# Altium schematic sheet Connectors.SchDoc: CONNECTORS
size A4; DocumentNumber: 2; SheetNumber: 2; SheetTotal: 18
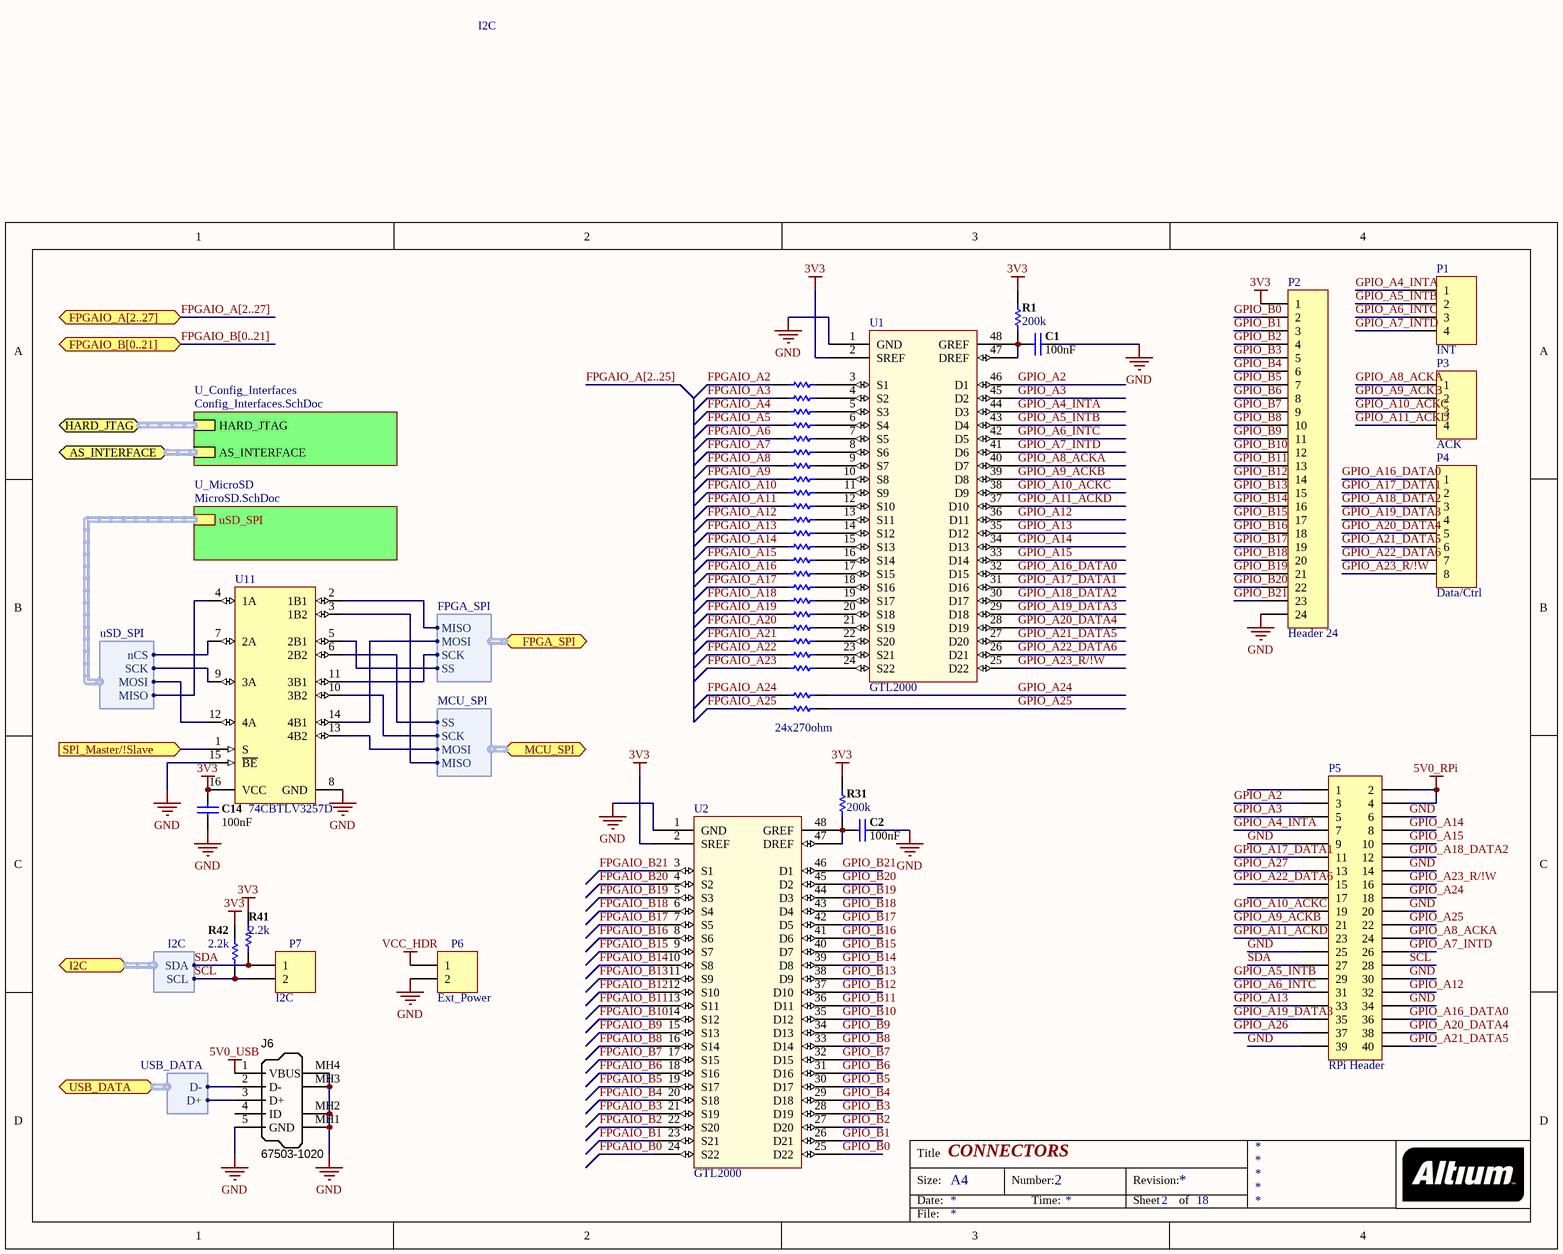
[diagram p0: Connectors.SchDoc]

## Parts
C1  100nF  [0805C-GENERIC]
C2  100nF  [0805C-GENERIC]
C14  100nF  [0805C-GENERIC]
J6  Manufacturer Part Number 1: 67503-1020  [USB_Mini-B_Molex_SMT]  (hidden comment: USB_Mini-B)
P1  Header 4  [HEADER-1X4]  (value not drawn)
P2  Header 24  [HDR1X24]
P3  Header 4  [HEADER-1X4]  (value not drawn)
P4  Header 8  [HEADER-1X8]  (value not drawn)
P5  Header 20X2  (value not drawn)
P6  Header 2  [Connector Molex 2]  (value not drawn)
P7  Header 2  [HEADER-1X2]  (value not drawn)
R1  200k  [0805R-220K]
R2  270  [0805R-270]  (value not drawn)
R5  270  [0805R-270]  (value not drawn)
R14  270  [0805R-270]  (value not drawn)
R15  270  [0805R-270]  (value not drawn)
R16  270  [0805R-270]  (value not drawn)
R17  270  [0805R-270]  (value not drawn)
R18  270  [0805R-270]  (value not drawn)
R19  270  [0805R-270]  (value not drawn)
R20  270  [0805R-270]  (value not drawn)
R21  270  [0805R-270]  (value not drawn)
R22  270  [0805R-270]  (value not drawn)
R23  270  [0805R-270]  (value not drawn)
R24  270  [0805R-270]  (value not drawn)
R25  270  [0805R-270]  (value not drawn)
R26  270  [0805R-270]  (value not drawn)
R27  270  [0805R-270]  (value not drawn)
R28  270  [0805R-270]  (value not drawn)
R29  270  [0805R-270]  (value not drawn)
R30  270  [0805R-270]  (value not drawn)
R31  200k  [0805R-220K]
R35  270  [0805R-270]  (value not drawn)
R36  270  [0805R-270]  (value not drawn)
R37  270  [0805R-270]  (value not drawn)
R38  270  [0805R-270]  (value not drawn)
R39  270  [0805R-270]  (value not drawn)
R41  2.2k  [0805R-0R1]
R42  2.2k  [0805R-0R1]
U1  GTL2000  [TSSOP50P810X120-48N]
U2  GTL2000  [TSSOP50P810X120-48N]
U11  74CBTLV3257D  [SO16]

## Sub-sheets
U_Config_Interfaces = Config_Interfaces.SchDoc: HARD_JTAG (harness HARD_JTAG), AS_INTERFACE (harness AS_INTERFACE)
U_MicroSD = MicroSD.SchDoc: uSD_SPI (harness uSD_SPI)

## Ports
AS_INTERFACE (harness AS_INTERFACE), FPGA_SPI (harness FPGA_SPI), FPGAIO_A[2..27] (bidir), FPGAIO_B[0..21] (bidir, harness TEST_INT), HARD_JTAG (harness HARD_JTAG), I2C (harness I2C), MCU_SPI (harness MCU_SPI), SPI_Master/!Slave (in), USB_DATA (harness USB_DATA)

## Harnesses
USB_DATA: D-, D+
FPGA_SPI: MISO, MOSI, SCK, SS
MCU_SPI: MISO, MOSI, SCK, SS
uSD_SPI: nCS, MOSI, MISO, SCK
I2C: SDA, SCL

## Nets
3V3: C14.1 P2.1 R1.2 R31.2 R41.1 R42.1 U1.2(SREF) U2.2(SREF) U11.16(VCC)
5V0_RPi: P5.2 P5.4
5V0_USB: J6.1(VBUS)
GND: C1.2 C2.2 C14.2 J6.5(GND) J6.MH1(Shell) J6.MH2(Shell) J6.MH3(Shell) J6.MH4(Shell) P2.24 P5.6 P5.9 P5.14 P5.20 P5.25 P5.30 P5.34 P5.39 P6.2 U1.1(GND) U2.1(GND) U11.8(GND) U11.15(~{BE})
VCC_HDR: P6.1
FPGAIO_A2: R2.1
FPGAIO_A3: R5.1
FPGAIO_A4: R37.1
FPGAIO_A5: R38.1
FPGAIO_A6: R39.1
FPGAIO_A7: R14.1
FPGAIO_A8: R15.1
FPGAIO_A9: R16.1
FPGAIO_A10: R17.1
FPGAIO_A11: R18.1
FPGAIO_A12: R19.1
FPGAIO_A13: R20.1
FPGAIO_A14: R21.1
FPGAIO_A15: R22.1
FPGAIO_A16: R23.1
FPGAIO_A17: R24.1
FPGAIO_A18: R25.1
FPGAIO_A19: R26.1
FPGAIO_A20: R27.1
FPGAIO_A21: R28.1
FPGAIO_A22: R29.1
FPGAIO_A23: R30.1
FPGAIO_A24: R35.1
FPGAIO_A25: R36.1
FPGAIO_B0: U2.24(S22)
FPGAIO_B1: U2.23(S21)
FPGAIO_B2: U2.22(S20)
FPGAIO_B3: U2.21(S19)
FPGAIO_B4: U2.20(S18)
FPGAIO_B5: U2.19(S17)
FPGAIO_B6: U2.18(S16)
FPGAIO_B7: U2.17(S15)
FPGAIO_B8: U2.16(S14)
FPGAIO_B9: U2.15(S13)
FPGAIO_B10: U2.14(S12)
FPGAIO_B11: U2.13(S11)
FPGAIO_B12: U2.12(S10)
FPGAIO_B13: U2.11(S9)
FPGAIO_B14: U2.10(S8)
FPGAIO_B15: U2.9(S7)
FPGAIO_B16: U2.8(S6)
FPGAIO_B17: U2.7(S5)
FPGAIO_B18: U2.6(S4)
FPGAIO_B19: U2.5(S3)
FPGAIO_B20: U2.4(S2)
FPGAIO_B21: U2.3(S1)
GPIO_A2: P5.3 U1.46(D1)
GPIO_A3: P5.5 U1.45(D2)
GPIO_A4_INTA: P1.1 P5.7 U1.44(D3)
GPIO_A5_INTB: P1.2 P5.29 U1.43(D4)
GPIO_A6_INTC: P1.3 P5.31 U1.42(D5)
GPIO_A7_INTD: P1.4 P5.26 U1.41(D6)
GPIO_A8_ACKA: P3.1 P5.24 U1.40(D7)
GPIO_A9_ACKB: P3.2 P5.21 U1.39(D8)
GPIO_A10_ACKC: P3.3 P5.19 U1.38(D9)
GPIO_A11_ACKD: P3.4 P5.23 U1.37(D10)
GPIO_A12: P5.32 U1.36(D11)
GPIO_A13: P5.33 U1.35(D12)
GPIO_A14: P5.8 U1.34(D13)
GPIO_A15: P5.10 U1.33(D14)
GPIO_A16_DATA0: P4.1 P5.36 U1.32(D15)
GPIO_A17_DATA1: P4.2 P5.11 U1.31(D16)
GPIO_A18_DATA2: P4.3 P5.12 U1.30(D17)
GPIO_A19_DATA3: P4.4 P5.35 U1.29(D18)
GPIO_A20_DATA4: P4.5 P5.38 U1.28(D19)
GPIO_A21_DATA5: P4.6 P5.40 U1.27(D20)
GPIO_A22_DATA6: P4.7 P5.15 U1.26(D21)
GPIO_A23_R/!W: P4.8 P5.16 U1.25(D22)
GPIO_A24: P5.18 R35.2
GPIO_A25: P5.22 R36.2
GPIO_A26: P5.37
GPIO_A27: P5.13
GPIO_B0: P2.2 U2.25(D22)
GPIO_B1: P2.3 U2.26(D21)
GPIO_B2: P2.4 U2.27(D20)
GPIO_B3: P2.5 U2.28(D19)
GPIO_B4: P2.6 U2.29(D18)
GPIO_B5: P2.7 U2.30(D17)
GPIO_B6: P2.8 U2.31(D16)
GPIO_B7: P2.9 U2.32(D15)
GPIO_B8: P2.10 U2.33(D14)
GPIO_B9: P2.11 U2.34(D13)
GPIO_B10: P2.12 U2.35(D12)
GPIO_B11: P2.13 U2.36(D11)
GPIO_B12: P2.14 U2.37(D10)
GPIO_B13: P2.15 U2.38(D9)
GPIO_B14: P2.16 U2.39(D8)
GPIO_B15: P2.17 U2.40(D7)
GPIO_B16: P2.18 U2.41(D6)
GPIO_B17: P2.19 U2.42(D5)
GPIO_B18: P2.20 U2.43(D4)
GPIO_B19: P2.21 U2.44(D3)
GPIO_B20: P2.22 U2.45(D2)
GPIO_B21: P2.23 U2.46(D1)
SCL: P5.28 P7.2 R42.2 ; port I2C.SCL
SDA: P5.27 P7.1 R41.2 ; port I2C.SDA
SPI_Master/!Slave: U11.1(S) ; port SPI_Master/!Slave
NetC1_1: C1.1 R1.1 U1.47(DREF) U1.48(GREF)
NetC2_1: C2.1 R31.1 U2.47(DREF) U2.48(GREF)
NetJ6_2: J6.2(D-) ; port USB_DATA.D-
NetJ6_3: J6.3(D+) ; port USB_DATA.D+
NetR2_2: R2.2 U1.3(S1)
NetR5_2: R5.2 U1.4(S2)
NetR14_2: R14.2 U1.8(S6)
NetR15_2: R15.2 U1.9(S7)
NetR16_2: R16.2 U1.10(S8)
NetR17_2: R17.2 U1.11(S9)
NetR18_2: R18.2 U1.12(S10)
NetR19_2: R19.2 U1.13(S11)
NetR20_2: R20.2 U1.14(S12)
NetR21_2: R21.2 U1.15(S13)
NetR22_2: R22.2 U1.16(S14)
NetR23_2: R23.2 U1.17(S15)
NetR24_2: R24.2 U1.18(S16)
NetR25_2: R25.2 U1.19(S17)
NetR26_2: R26.2 U1.20(S18)
NetR27_2: R27.2 U1.21(S19)
NetR28_2: R28.2 U1.22(S20)
NetR29_2: R29.2 U1.23(S21)
NetR30_2: R30.2 U1.24(S22)
NetR37_2: R37.2 U1.5(S3)
NetR38_2: R38.2 U1.6(S4)
NetR39_2: R39.2 U1.7(S5)
NetU11_2: U11.2(1B1) ; port FPGA_SPI.MISO
NetU11_3: U11.3(1B2) ; port MCU_SPI.MISO
NetU11_4: U11.4(1A) ; sheet U_MicroSD/uSD_SPI.MISO
NetU11_5: U11.5(2B1) ; port FPGA_SPI.SS
NetU11_6: U11.6(2B2) ; port MCU_SPI.SS
NetU11_7: U11.7(2A) ; sheet U_MicroSD/uSD_SPI.nCS
NetU11_9: U11.9(3A) ; sheet U_MicroSD/uSD_SPI.SCK
NetU11_10: U11.10(3B2) ; port MCU_SPI.SCK
NetU11_11: U11.11(3B1) ; port FPGA_SPI.SCK
NetU11_12: U11.12(4A) ; sheet U_MicroSD/uSD_SPI.MOSI
NetU11_13: U11.13(4B2) ; port MCU_SPI.MOSI
NetU11_14: U11.14(4B1) ; port FPGA_SPI.MOSI

Not connected (* = marked no-connect by the designer): J6 4(ID); P5 1 17

## Buses and harness runs
bus FPGAIO_A[2..25]
bus FPGAIO_A[2..27] = port FPGAIO_A[2..27]
bus FPGAIO_B[0..21]
harness port AS_INTERFACE = sheet U_Config_Interfaces/AS_INTERFACE
harness port HARD_JTAG = sheet U_Config_Interfaces/HARD_JTAG

## Notes on the sheet
- I2C
- (near P1) INT
- (near P3) ACK
- (near P4) Data/Ctrl
- (near R36) 24x270ohm
- (near P7) I2C
- (near P6) Ext_Power
- (near P5) RPi Header
- Title
- Size:
- Date:
- A4
- Number:
- Time:
- Revision:
- Sheet
- of
- File:

## Library data of the parts
C1 C2 C14 = D-101-0027: Capacitor, Ceramic, 10% 10V 0805 X7R; Polarity: Non-Polarized; Capacitance: 100nF; Dielectric: X7R; Mounting Technology: Surface Mount; Rated Voltage: 10 V; Status: Production; Technology: Ceramic; Tolerance: 10 %; Category: Capacitor
J6 = USB_Mini-B: Connector SMD USB Type Mini-B; Manufacturer 1: Molex Connector Corporation; SCDType: undef; Package / Case: SMD; Supplier 1: Digi-Key; Supplier Part Number 1: WM5461CT-ND
P1 P3 = Header 4: Header, 4-Pin; LatestRevisionDate: 17-Jul-2002; LatestRevisionNote: Re-released for DXP Platform.; Publisher: Altium Limited
P2 = Header 24: Header, 24-Pin; LatestRevisionDate: 17-Jul-2002; LatestRevisionNote: Re-released for DXP Platform.; Publisher: Altium Limited
P4 = Header 8: Header, 8-Pin; LatestRevisionDate: 17-Jul-2002; LatestRevisionNote: Re-released for DXP Platform.; Publisher: Altium Limited
P5 = Header 20X2: Header, 20-Pin, Dual row; LatestRevisionDate: 17-Jul-2002; LatestRevisionNote: Re-released for DXP Platform.; Publisher: Altium Limited
P6 P7 = Header 2: Header, 2-Pin; LatestRevisionDate: 17-Jul-2002; LatestRevisionNote: Re-released for DXP Platform.; Publisher: Altium Limited
R1 R2 R5 R14-R31 R35-R39 R41 R42 = D-100-0116: Tolerance: 1 %; Mounting Technology: Surface Mount; Status: Production; Category: Resistor
  R1 R31: Value: 200k
  R2 R5 R14-R30 R35-R39: Value: 270
  R41 R42: Value: 2.2k
U1 U2 = GTL2000: 22-bit bi-directional low voltage translator
U11 = ADG3257BRQ: 933 Mbps, High Speed, 3.3 V / 5 V Quad 2:1 Mux / Demux (4-Bit, 1 of 2) Bus Switch, 100 ps Prop Delay, -40 to 85 degC, 16-pin SOP (RQ-16), Tube; Manufacturer: Analog Devices; ICC1: 1uA; DatasheetVersion: Rev. E; PackageVersion: Aug-05; PackageReference: RQ-16; PackageDescription: 16-Pin Shrink Small Outline Package, Body 4.9 x 3.9 mm, Pitch 0.64 mm; Supplier 1: Digi-Key; Supplier Part Number 1: ADG3257BRQ-ND; Supplier 2: Mouser; Supplier Part Number 2: 584-ADG3257BRQ; Data Rate (typ): 933Mbps; Packing: Tube; Mounting Technology: Surface Mount; Code_JEDEC: MO-137-AB; PartNumber: ADG3257BRQ; ComponentLink1Description: Manufacturer URL; ComponentLink1URL: http://www.analog.com/en/index.html; ComponentLink2Description: Datasheet; ComponentLink2URL: http://www.analog.com/static/imported-files/data_sheets/ADG3257.pdf; ComponentLink3Description: Package Specification; ComponentLink3URL: http://www.analog.com/static/imported-files/packages/5595549651201762937RQ_16.pdf